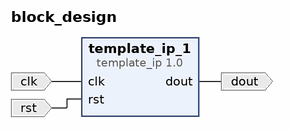
[diagram p0: block diagram of the top level]
# Vivado block design block_design, xc7a100tftg256-2, Vivado 2025.2
create_bd_design block_design

create_bd_port -dir I -type clk clk
create_bd_port -dir I -type rst rst
create_bd_port -dir O dout

create_bd_cell -type ip -vlnv user.org:user:template_ip:1.0 template_ip_1

# ---- connections ----

connect_bd_net [get_bd_ports clk] [get_bd_pins template_ip_1/clk]
connect_bd_net [get_bd_ports rst] [get_bd_pins template_ip_1/rst]
connect_bd_net [get_bd_pins template_ip_1/dout] [get_bd_ports dout]

validate_bd_design
save_bd_design
